# EAGLE design Kinefox_v5 (EAGLE 9.6.2)
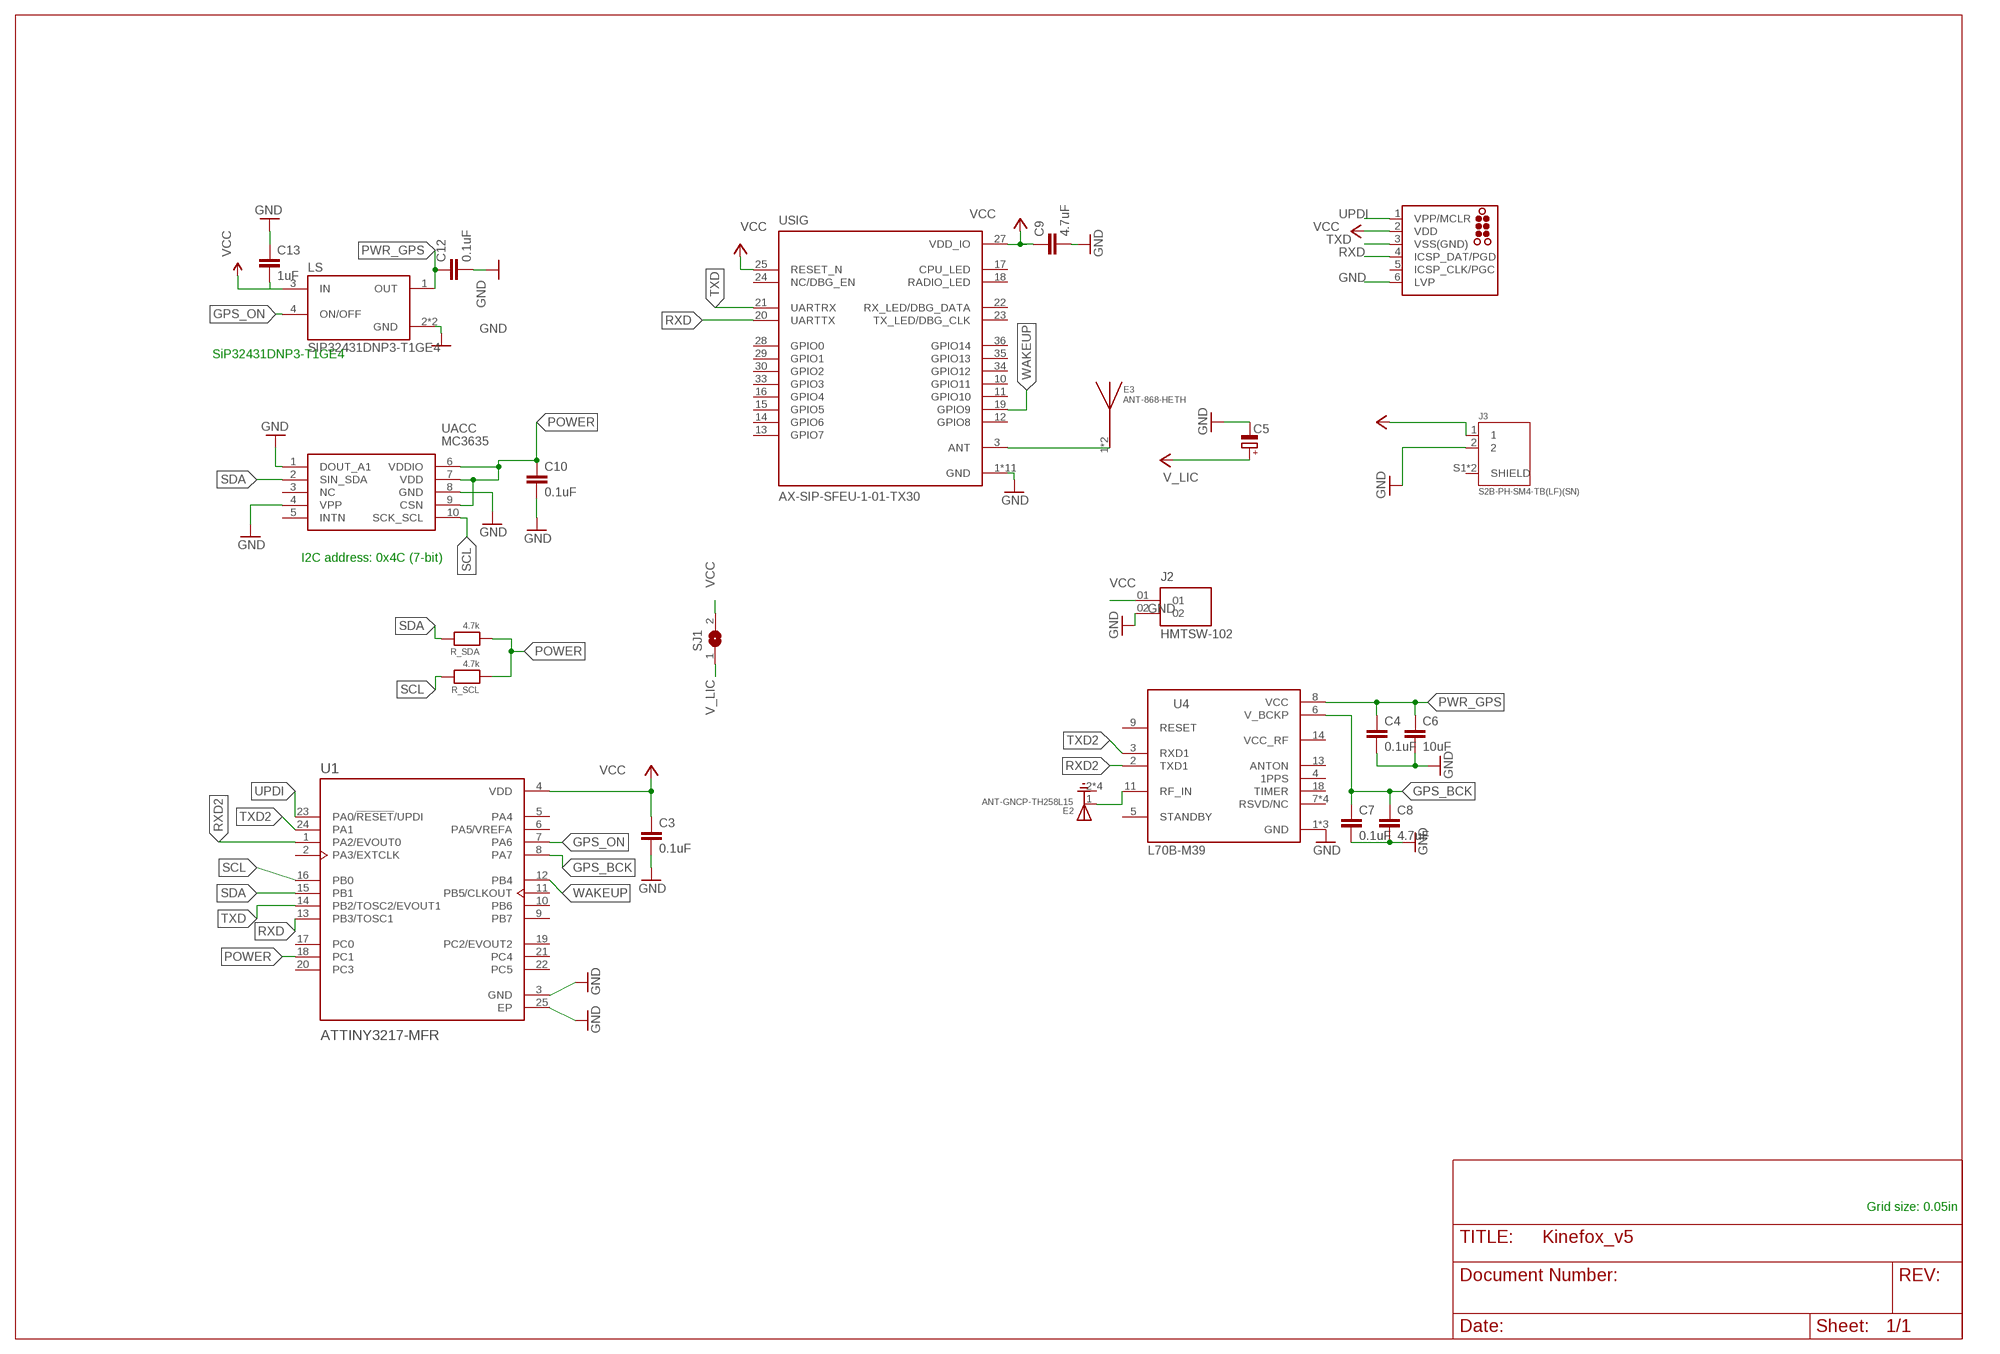
[diagram p0: schematic, sheet 1]

## Parts
C3  0.1uF  C0402_8PF  [C0402]
C4  0.1uF  C0402_8PF  [C0402]
C5  CPOL-EUE3.5-8  [E3,5-8]
C6  10uF  C0402_8PF  [C0402]
C7  0.1uF  C0402_8PF  [C0402]
C8  4.7uF  C0402_8PF  [C0402]
C9  4.7uF  C0402_8PF  [C0402]
C10  0.1uF  C0402_8PF  [C0402]
C12  0.1uF  C0402_8PF  [C0402]
C13  1uF  C0402_8PF  [C0402]
E2  ANT-GNCP-TH258L15  [XCVR_ANT-GNCP-TH258L15]
E3  ANT-868-HETH  [XDCR_ANT-868-HETH]
J1  TC2030-MCP-NL  [TC2030-MCP-NL]
J2  HMTSW-102  HMTSW-102-XX-X-S-XXX  [SAMTEC_HMTSW-102-XX-X-S-XXX]
J3  S2B-PH-SM4-TB(LF)(SN)  [JST_S2B-PH-SM4-TB(LF)(SN)]
LS  SIP32431DNP3-T1GE4  [SON50P120X160X60-5N]
R_SCL  4.7k  MICROBUILDER_RESISTOR_0402  [MICROBUILDER__0402]
R_SDA  4.7k  MICROBUILDER_RESISTOR_0402  [MICROBUILDER__0402]
SJ1  SJ  [SJ]
U1  ATTINY3217-MFR  [QFN50P400X400X90-25N]
U4  L70B-M39  [XCVR_L70B-M39]
UACC  MC3635  [MC3635]
USIG  AX-SIP-SFEU-1-01-TX30  [IC_AX-SIP-SFEU-1-01-TX30]

## Nets
GND: C3.2 C4.2 C5.- C6.2 C7.2 C8.2 C9.2 C10.2 C12.2 C13.1 J1.6(LVP) J2.02 J3.2 LS.2(GND) LS.5(GND) U1.3(GND) U1.25(EP) U4.1(GND) U4.10(GND) U4.12(GND) UACC.1(DOUT_A1) UACC.4(VPP) UACC.8(GND) USIG.1(GND) USIG.2(GND) USIG.4(GND) USIG.6(GND) USIG.26(GND) USIG.P1(GND) USIG.P2(GND) USIG.P3(GND) USIG.P4(GND) USIG.P5(GND) USIG.P6(GND)
GPS_ANT: E2.1(FEEDING) U4.11(RF_IN)
GPS_BCK: C7.1 C8.1 U1.8(PA7) U4.6(V_BCKP)
GPS_ON: LS.4(ON/OFF) U1.7(PA6)
POWER: C10.1 R_SCL.1 R_SDA.1 U1.18(PC1) UACC.6(VDDIO) UACC.7(VDD) UACC.9(CSN)
PWR_GPS: C4.1 C6.1 C12.1 LS.1(OUT) U4.8(VCC)
RXD: J1.4(ICSP_DAT/PGD) U1.13(PB3/TOSC1) USIG.20(UARTTX)
RXD2: U1.1(PA2/EVOUT0) U4.2(TXD1)
SCL: R_SCL.2 U1.16(PB0) UACC.10(SCK_SCL)
SDA: R_SDA.2 U1.15(PB1) UACC.2(SIN_SDA)
SIG_ANT: E3.1(FEED) E3.3(FEED) USIG.3(ANT)
TXD: J1.3(VSS(GND)) U1.14(PB2/TOSC2/EVOUT1) USIG.21(UARTRX)
TXD2: U1.24(PA1) U4.3(RXD1)
UPDI: J1.1(VPP/MCLR) U1.23(PA0/!RESET!/UPDI)
V_LIC: C5.+ SJ1.1 ; supply symbol labelled VCC
VCC: C3.1 C9.1 C13.2 J1.2(VDD) J2.01 J3.1 LS.3(IN) SJ1.2 U1.4(VDD) USIG.25(RESET_N) USIG.27(VDD_IO) ; supply symbol labelled V_BATT
WAKEUP: U1.12(PB4) USIG.19(GPIO9)
Unconnected: J1.5(ICSP_CLK/PGC) J3.S1(SHIELD) J3.S2(SHIELD) U1.2(PA3/EXTCLK) U1.5(PA4) U1.6(PA5/VREFA) U1.9(PB7) U1.10(PB6) U1.11(PB5/CLKOUT) U1.17(PC0) U1.19(PC2/EVOUT2) U1.20(PC3) U1.21(PC4) U1.22(PC5) U4.4(1PPS) U4.5(STANDBY) U4.7(RSVD/NC) U4.9(RESET) U4.13(ANTON) U4.14(VCC_RF) U4.15(RSVD/NC) U4.16(RSVD/NC) U4.17(RSVD/NC) U4.18(TIMER) UACC.3(NC) UACC.5(INTN) USIG.10(GPIO11) USIG.11(GPIO10) USIG.12(GPIO8) USIG.13(GPIO7) USIG.14(GPIO6) USIG.15(GPIO5) USIG.16(GPIO4) USIG.17(CPU_LED) USIG.18(RADIO_LED) USIG.22(RX_LED/DBG_DATA) USIG.23(TX_LED/DBG_CLK) USIG.24(NC/DBG_EN) USIG.28(GPIO0) USIG.29(GPIO1) USIG.30(GPIO2) USIG.33(GPIO3) USIG.34(GPIO12) USIG.35(GPIO13) USIG.36(GPIO14)

## Notes on the sheet
- SiP32431DNP3-T1GE4
- I2C address: 0x4C (7-bit)
- Grid size: 0.05in

## Power pins joined to a net without a drawn wire
GND: E2.2(GND) E2.3(GND) E2.4(GND) E2.5(GND)

## Library data of the parts
C3 C4 C6-C10 C12 C13 = TSEM:C: Non-polarized capacitor; FARNELL_OC: 2210758; MF: TDK; MPN: CGA2B2C0G1H080D050BA; VALUE: 8pF
C5 = qfm-trx1-24g:CPOL-EU: POLARIZED CAPACITOR, European symbol
E2 = ANT-GNCP-TH258L15:ANT-GNCP-TH258L15: L1/L5 Ceramic Patch GNSS Antenna Check availability <https://pricing.snapeda.com/parts/ANT-GNCP-TH258L15/Linx%20Technologies%20Inc./view-part?ref=eda>; AVAILABILITY: In Stock; DESCRIPTION: GNSS L1/L5 Dual-Band Radiating Patch Ceramic Patch Antenna, Internal/Embedded Through-Hole Mount, Solder Pin; MF: Linx Technologies Inc.; MP: ANT-GNCP-TH258L15; PACKAGE: None; PRICE: None; PURCHASE-URL: https://pricing.snapeda.com/search/part/ANT-GNCP-TH258L15/?ref=eda
E3 = ANT-868-HETH:ANT-868-HETH: 868MHZ HELICAL ANT THROUGH HOLE Check availability <https://pricing.snapeda.com/parts/ANT-868-HETH/Linx/view-part?ref=eda>; AVAILABILITY: In Stock; DESCRIPTION: 868MHz ISM, LPWA Helical RF Antenna 862MHz ~ 876MHz 5.6dBi Solder Through Hole; MF: Linx; MP: ANT-868-HETH; PACKAGE: None; PRICE: None; PURCHASE-URL: https://pricing.snapeda.com/search/part/ANT-868-HETH/?ref=eda
J1 = tag-connect:TC2030: TAG-CONNECT ICSP Connector Manufacturer: Tag-Connect <http://www.tag-connect.com> Cable for easy In-Circuit Serial Programming. Designed for Microchip ICD2, suitable for many others. Two variants - one "with legs" (for hands-free fit on PCB) and another "without legs" for quick programming. PAD Description 1 MCLR/Vpp 2 Vdd 3 GND 4 PGD (ISPDAT) 5 PGC (ISPCLK) 6 nc (used for LVP) ©2009 ROFA.cz - modified and updated by Robert Darlington ‹rdarlington@gmail.com›
J2 = HMTSW-102-XX-X-S-XXX:HMTSW-102-XX-X-S-XXX: Connector Header Through Hole 2 position 0.100" (2.54mm) Check availability <https://pricing.snapeda.com/parts/HMTSW-102-06-T-S-000/Samtec/view-part?ref=eda>; AVAILABILITY: In Stock; DESCRIPTION: Conn Unshrouded Header HDR 2 POS 2.54mm Solder ST Top Entry Thru-Hole Bulk; MF: Samtec; MP: HMTSW-102-06-T-S-000; PACKAGE: None; PRICE: None; PURCHASE-URL: https://pricing.snapeda.com/search/part/HMTSW-102-06-T-S-000/?ref=eda
J3 = S2B-PH-SM4-TB_LF__SN_:S2B-PH-SM4-TB(LF)(SN): PH Series 2 Position 2 mm Pitch Surface Mount Side Entry Shrouded Header Check availability <https://pricing.snapeda.com/parts/S2B-PH-SM4-TB%28LF%29%28SN%29/JST%20Sales/view-part?ref=eda>; AVAILABILITY: In Stock; DESCRIPTION: Connector Header Surface Mount, Right Angle 2 position 0.079 (2.00mm); MF: JST Sales; MP: S2B-PH-SM4-TB(LF)(SN); PACKAGE: None; PRICE: None; PURCHASE-URL: https://pricing.snapeda.com/search/part/S2B-PH-SM4-TB(LF)(SN)/?ref=eda
LS = SIP32431DNP3-T1GE4:SIP32431DNP3-T1GE4: Power Switch/Driver 1:1 P-Channel 1.4A 4-TDFN (1.2x1.6) Check prices <https://pricing.snapeda.com/parts/SIP32431DNP3-T1GE4/Vishay%20Siliconix/view-part?ref=eda>; AVAILABILITY: In Stock; DESCRIPTION: Power Switch/Driver 1:1 P-Channel 1.4A 4-TDFN (1.2x1.6); MF: Vishay Siliconix; MP: SIP32431DNP3-T1GE4; PACKAGE: UFDFN-4 Vishay Siliconix; PRICE: None; PURCHASE-URL: https://pricing.snapeda.com/search/part/SIP32431DNP3-T1GE4/?ref=eda
R_SCL R_SDA = TinyPICO:MICROBUILDER_RESISTOR: Resistors 0402 - 0402 Surface Mount Package 22 Ohm 1% 1/16W [Digikey: 311-22.0LRTR-ND] 33 Ohm 5% 1/16W 1.0K 5% 1/16W 1.5K 5% 1/16W 2.0K 1% 1/16W 10.0K 1% 1/16W [Digikey: 311-10.0KLRTR-ND] 10.0K 5% 1/16W [Digikey: RMCF0402JT10K0TR-ND] 12.1K 1% 1/16W [Digikey: 311-22.0LRTR-ND] 100.0K 5% 1/16W 0603 - 0603 Surface Mount Package 0 Ohm 1/10 Watt 1% Resistor 15 Ohm 1/10 Watt 1% Resistor 33 Ohm 1/10 Watt 1% Resistor 49.9 Ohm 1/10 Watt 1% Resistor 100 Ohm 1/10 Watt 1% Resistor 150 Ohm 1/10 Watt 1% Resistor 240 Ohm 1/10 Watt 1% Resistor 390 Ohm 1/10 Watt 1% Resistor 560 Ohm 1/10 Watt 1% Resistor 680 Ohm 1/10 Watt 1% Resistor 750 Ohm 1/10 Watt 1% Resistor 1.0K Ohm 1/10 Watt 1% Resistor 1.5K Ohm 1/10 Watt 1% Resistor 2.0K Ohm 1/10 Watt 1% Resistor 2.2K Ohm 1/10 Watt 1% Resistor 3.3K Ohm 1/10 Watt 1% Resistor 4.7K Ohm 1/10 Watt 1% Resistor 10.0K Ohm 1/10 Watt 1% Resistor 12.0K Ohm 1/10 Watt 1% Resistor 12.1K Ohm 1/10 Watt 1% Resistor 20.0K Ohm 1/10 Watt 1% Resistor 33.0K Ohm 1/10 Watt 1% Resistor 100.0K Ohm 1/10 Watt 1% Resistor 0805 - 0805 Surface Mount Package 0 Ohm 1/8 Watt 1% Resistor 33 Ohm 1/8 Watt 1% Resistor 100 Ohm 1/8 Watt 1% Resistor 150 Ohm 1/8 Watt 1% Resistor 200 Ohm 1/8 Watt 1% Resistor 240 Ohm 1/8 Watt 1% Resistor 330 Ohm 1/8 Watt 1% Resistor 390 Ohm 1/8 Watt 1% Resistor 470 Ohm 1/8 Watt 1% Resistor 1.0K Ohm 1/8 Watt 1% Resistor 1.5K Ohm 1/8 Watt 1% Resistor 2.0K Ohm 1/8 Watt 1% Resistor 4.7K Ohm 1/8 Watt 1% Resistor 5.1K Ohm 1/8 Watt 1% Resistor 5.6K Ohm 1/8 Watt 1% Resistor 10.0K Ohm 1/8 Watt 1% Resistor 22.0K Ohm 1/8 Watt 1% Resistor 33.0K Ohm 1/8 Watt 1% Resistor 100K Ohm 1/8 Watt 1% Resistor 1206 - 1206 Surface Mount Package 2012 - 2010 Surface Mount Package 0.11 Ohm 1/2 Watt 1% Resistor - Digikey: RHM.11UCT-ND
SJ1 = jumper:SJ: SMD solder JUMPER
U1 = ATTINY3217-MFR:ATTINY3217-MFR: 20MHZ, 32KB, QFN24, Ind 125C, Green, T&r Check availability <https://pricing.snapeda.com/parts/ATTINY3217-MFR/Microchip/view-part?ref=eda>; AVAILABILITY: In Stock; DESCRIPTION: AVR tinyAVR™ 1, Functional Safety (FuSa) Microcontroller IC 8-Bit 16MHz 32KB (32K x 8) FLASH 24-VQFN (4x4); MF: Microchip; MP: ATTINY3217-MFR; PACKAGE: VFQFN-24 Microchip Technology; PRICE: None; PURCHASE-URL: https://pricing.snapeda.com/search/part/ATTINY3217-MFR/?ref=eda
U4 = L70B-M39:L70B-M39: GPS Module Check prices <https://pricing.snapeda.com/parts/L70B-M39/Quectel/view-part?ref=eda> Check prices <https://pricing.snapeda.com/parts/L70B-M39/Quectel/view-part?ref=eda> Check availability <https://pricing.snapeda.com/parts/L70B-M39/Quectel/view-part?ref=eda>; AVAILABILITY: In Stock; DESCRIPTION: L70, an SMD type module, brings the high performance of MTK positioning engine to the industrial applications with compact profile, ultra low power consumption and fast positioning capability.; MF: Quectel; MP: L70B-M39; PACKAGE: None; PRICE: None; PURCHASE-URL: https://pricing.snapeda.com/search/part/L70B-M39/?ref=eda
UACC = MC3635:MC3635: Accelerometers Digital Output 3 Axis Acceleronmeter Source: Datasheet <http://www.mcubemems.com/wp-content/uploads/2017/09/MC3635-Datasheet-APS-048-0044v1.5.pdf>; ARROW_PART_NUMBER: MC3635; ARROW_PRICE-STOCK: https://www.arrow.com/en/products/mc3635/mcube-inc; DESCRIPTION: Accelerometers Digital Output 3 Axis Acceleronmeter; HEIGHT: 0.94mm; MANUFACTURER_NAME: mCube; MANUFACTURER_PART_NUMBER: MC3635; MOUSER_PART_NUMBER: 498-MC3635; MOUSER_PRICE-STOCK: https://www.mouser.co.uk/ProductDetail/mCube/MC3635?qs=xIT89idmjZlQ0wKEjJ43VQ%3D%3D
USIG = AX-SIP-SFEU-1-01-TX30-V2:AX-SIP-SFEU-1-01-TX30: RF-MICROCONTROLLER, ULTRA Check prices <https://pricing.snapeda.com/parts/AX-SIP-SFEU-1-01-TX30/ON%20Semiconductor/view-part?ref=eda>; AVAILABILITY: In Stock; DESCRIPTION: Sigfox Transceiver Module 868.13MHz, 869.525MHz Antenna Not Included Surface Mount; MF: ON Semiconductor; MP: AX-SIP-SFEU-1-01-TX30; PACKAGE: SIP-38 ON Semiconductor; PRICE: None

## Board
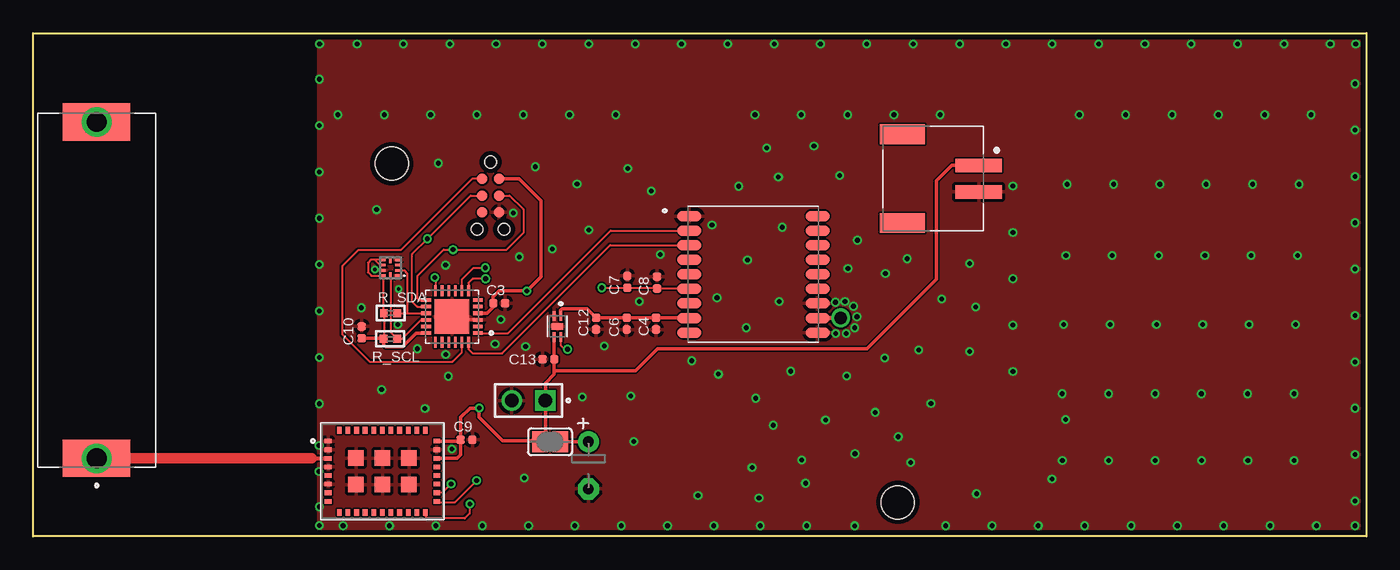
[diagram p1: board, top side]
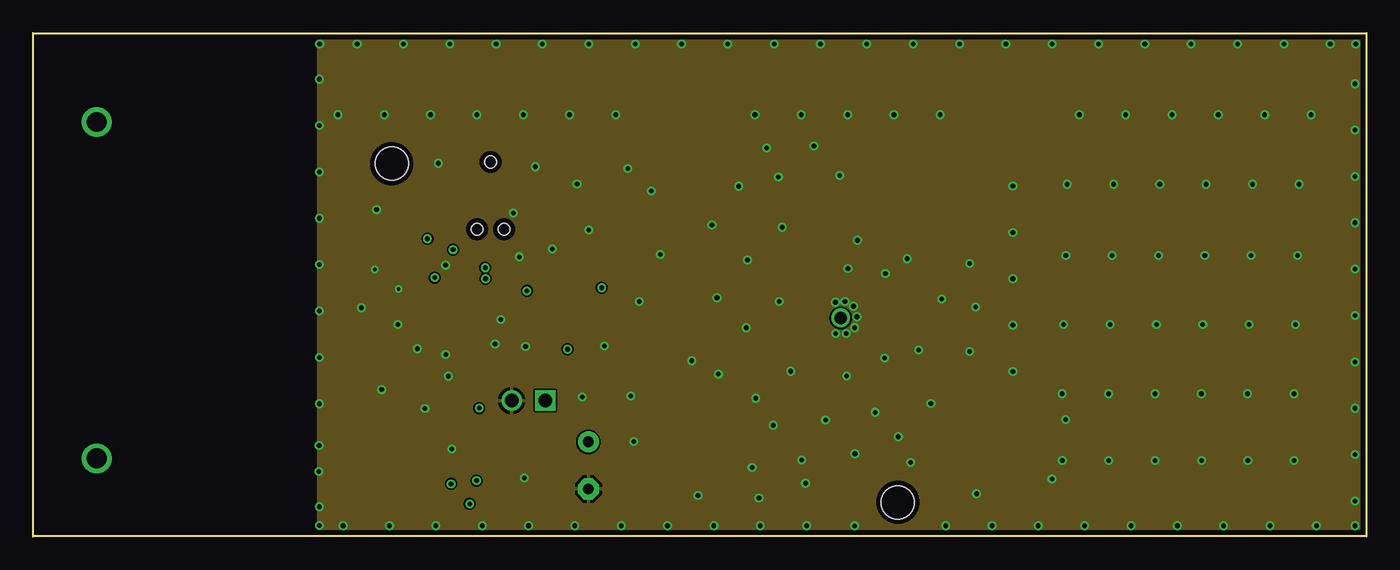
[diagram p2: board, inner layer GND]
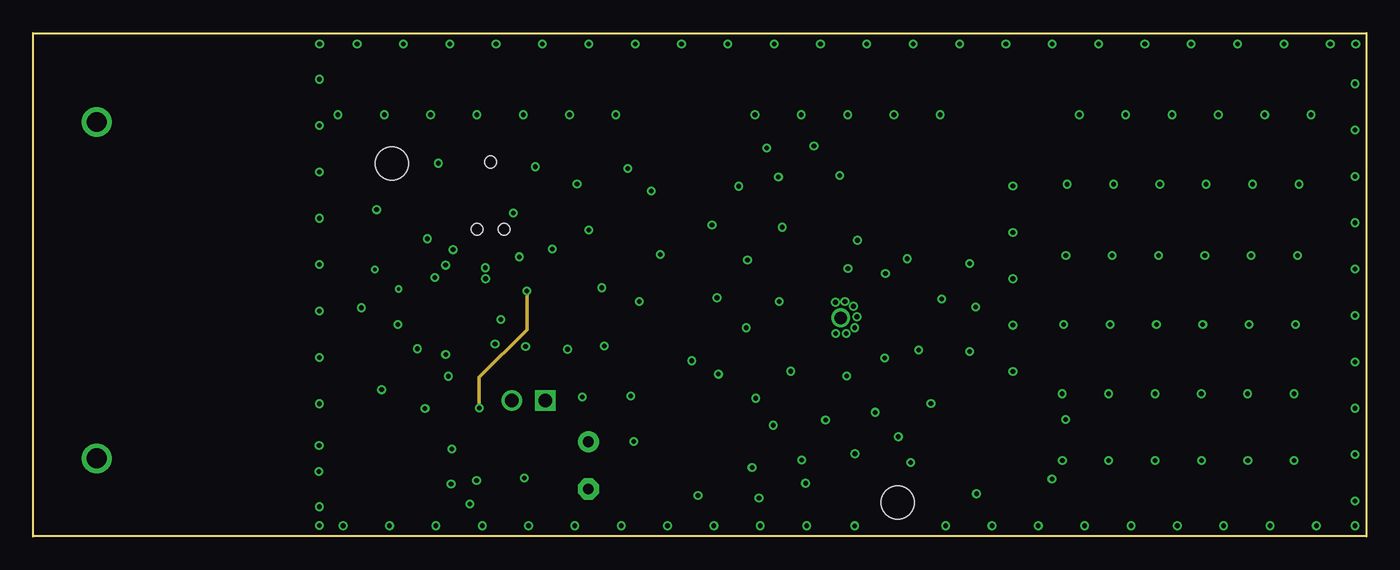
[diagram p3: board, inner layer 3.3V]
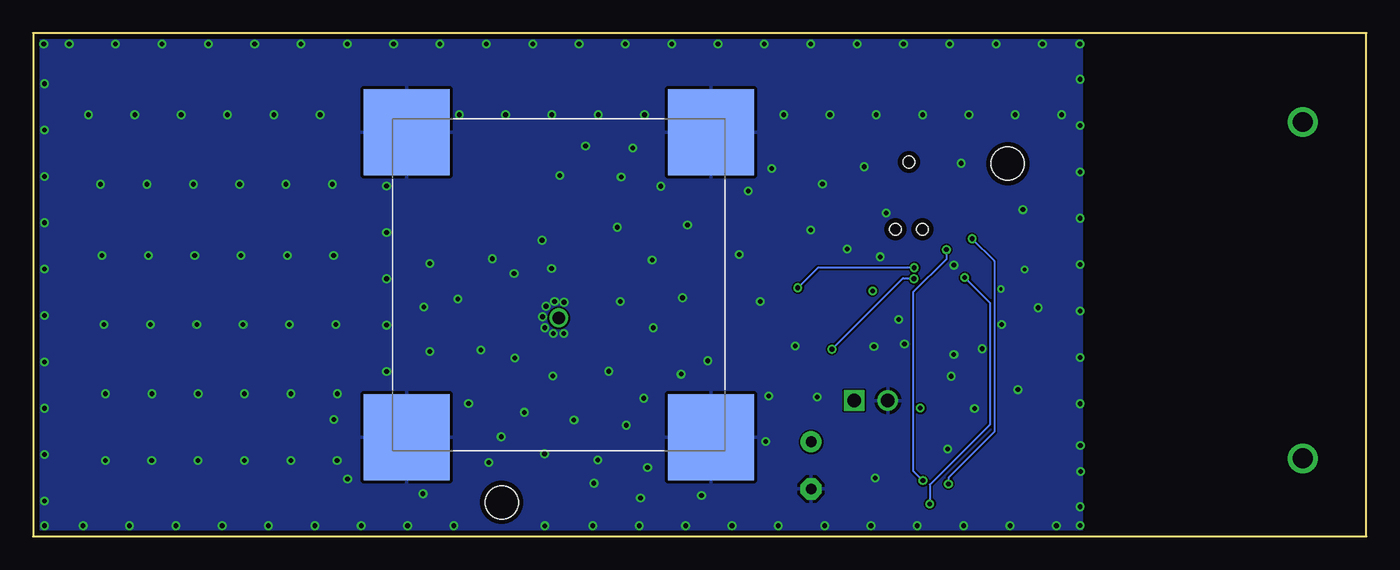
[diagram p4: board, bottom side, seen from below]

Size 100.7 x 38 mm. Coordinates in mm from the lower left corner, seen from the top.
Outline: 0,0 0,38 100.7,38 100.7,0 0,0
Copper layers (1+2*15+16): Top 0.0356mm / dielectric 0.1702mm / GND 0.0178mm / dielectric 47mil / 3.3V 0.0178mm / dielectric 0.1702mm / Bottom 0.0356mm
Design rules "ESP32-TrackerREV2-4LayerOSHPark *": minimum track width 5mil, minimum drill 0.2mm, track to track 5mil, track to pad 5mil, pad to pad 5mil, via to via 5mil, smd to smd 5mil, copper to edge 15mil, drill to drill 6mil, minimum pad ring 6mil, minimum via ring 6mil, stop-mask expansion 0mil, vias tented up to drill 12mil, thermal gap 10mil
Holes 2.5 mm at 27.08,28.14 65.31,2.57

### Footprints (pad centres in the part's own frame; a part is rotated, then mirrored left to right if it is on the bottom)
C0402 = smd 0.635 x 0.635: 1 -0.445,0; 2 0.445,0
E3,5-8 = drill 0.813 pad 1.6: + -1.778,0 | drill 0.813 pad 1.6 octagon: - 1.778,0
XCVR_ANT-GNCP-TH258L15 = drill 0.95: 1 0,-2.5 | smd 6.5 x 6.5: 2 11.5,11.5; 3 -11.5,11.5; 4 -11.5,-11.5; 5 11.5,-11.5
XDCR_ANT-868-HETH = smd 2.8 x 5.1: 1 -12.7,0; 2 12.7,0 | drill 1.5: 3 -12.7,0; 4 12.7,0
TC2030-MCP-NL = smd 0.787 x 0.787: 1 1.27,-0.635; 2 1.27,0.635; 3 2.54,-0.635; 4 2.54,0.635; 5 3.81,-0.635; 6 3.81,0.635 | hole 0.889: 0,0; 5.08,-1.016; 5.08,1.016
SAMTEC_HMTSW-102-XX-X-S-XXX = drill 1.02 square: 01 1.27,0 | drill 1.02: 02 -1.27,0
JST_S2B-PH-SM4-TB(LF)(SN) = smd 1 x 3.5: 1 -1,0; 2 1,0 | smd 1.5 x 3.4: S1 -3.35,-5.75; S2 3.35,-5.75
SON50P120X160X60-5N = smd 0.71 x 0.27: 1 -0.795,0.25; 2 -0.795,-0.25; 3 0.795,-0.25; 4 0.795,0.25 | smd 0.5 x 0.86: 5 0,0
MICROBUILDER__0402 = smd 0.6 x 0.6: 1 -0.508,0; 2 0.508,0
SJ = smd 1.168 x 1.6: 1 -0.762,0; 2 0.762,0
QFN50P400X400X90-25N = smd 0.81 x 0.26: 1 -1.95,1.25; 2 -1.95,0.75; 3 -1.95,0.25; 4 -1.95,-0.25; 5 -1.95,-0.75; 6 -1.95,-1.25; 13 1.95,-1.25; 14 1.95,-0.75; 15 1.95,-0.25; 16 1.95,0.25; 17 1.95,0.75; 18 1.95,1.25 | smd 0.26 x 0.81: 7 -1.25,-1.95; 8 -0.75,-1.95; 9 -0.25,-1.95; 10 0.25,-1.95; 11 0.75,-1.95; 12 1.25,-1.95; 19 1.25,1.95; 20 0.75,1.95; 21 0.25,1.95; 22 -0.25,1.95; 23 -0.75,1.95; 24 -1.25,1.95 | smd 2.6 x 2.6: 25 0,0
XCVR_L70B-M39 = smd 1.8 x 0.8: 1 -4.85,4.4; 2 -4.85,3.3; 3 -4.85,2.2; 4 -4.85,1.1; 5 -4.85,0; 6 -4.85,-1.1; 7 -4.85,-2.2; 8 -4.85,-3.3; 9 -4.85,-4.4; 10 4.85,-4.4; 11 4.85,-3.3; 12 4.85,-2.2; 13 4.85,-1.1; 14 4.85,0; 15 4.85,1.1; 16 4.85,2.2; 17 4.85,3.3; 18 4.85,4.4
MC3635 = smd 0.2 x 0.4: 1 -0.6,-0.55; 2 -0.2,-0.55; 3 0.2,-0.55; 4 0.6,-0.55; 6 0.6,0.55; 7 0.2,0.55; 8 -0.2,0.55; 9 -0.6,0.55 | smd 0.4 x 0.2: 5 0.55,0; 10 -0.55,0
IC_AX-SIP-SFEU-1-01-TX30 = smd 0.5 x 0.35: 1 -4.1,2.275; 2 -4.1,1.625; 3 -4.1,0.975; 4 -4.1,0.325; 5 -4.1,-0.325; 6 -4.1,-0.975; 7 -4.1,-1.625; 8 -4.1,-2.275; 20 4.1,-2.275; 21 4.1,-1.625; 22 4.1,-0.975; 23 4.1,-0.325; 24 4.1,0.325; 25 4.1,0.975; 26 4.1,1.625; 27 4.1,2.275 | smd 0.35 x 0.5: 9 -3.25,-3.1; 10 -2.6,-3.1; 11 -1.95,-3.1; 12 -1.3,-3.1; 13 -0.65,-3.1; 14 0,-3.1; 15 0.65,-3.1; 16 1.3,-3.1; 17 1.95,-3.1; 18 2.6,-3.1; 19 3.25,-3.1; 28 3.25,3.1; 29 2.6,3.1; 30 1.95,3.1; 31 1.3,3.1; 32 0.65,3.1; 33 0,3.1; 34 -0.65,3.1; 35 -1.3,3.1; 36 -1.95,3.1; 37 -2.6,3.1; 38 -3.25,3.1 | smd 1.2 x 1.2: P1 -2,1; P2 -2,-1; P3 0,-1; P4 2,-1; P5 2,1; P6 0,1

### Placement (x,y rotation side)
C3  35.2,17.6 0 top
C4  47.04,16.06 270 top
C5  41.94,5.36 270 top
C6  44.83,16.06 270 top
C7  44.88,19.22 90 top
C8  47.12,19.17 90 top
C9  32.73,7.3 0 top
C10  24.81,15.41 90 top
C12  42.51,16.07 270 top
C13  38.92,13.38 0 top
E2  61,19 0 bottom
E3  4.8,18.59 90 top
J1  34.55,28.27 270 top
J2  37.42,10.26 0 top
J3  71.42,27.01 270 top
LS  39.6,15.86 270 top
R_SCL  26.98,14.92 0 top
R_SDA  27,16.86 0 top
SJ1  39.04,7.14 180 top
U1  31.64,16.6 180 top
U4  54.4,19.79 0 top
UACC  26.99,20.28 90 top
USIG  26.38,4.92 0 top

### Tracks (layer width: path | path; a pad name or v marks a point on that pad's centre or on a via)
GND  (via drill 0.25, 0.35)
  Top 0.254: U1.3 31.89,16.35
  Top 0.35: 31.89,16.35 U1.25
  other vias: 31.62,6.59 21.6,6.87 21.58,4.91 21.62,2.24 21.61,0.82 21.62,10.02 21.62,13.52 21.62,17.02 21.62,20.52 21.62,24.02 21.62,27.52 21.62,31.02 21.62,34.52 21.64,37.19 24.47,37.19 27.97,37.19 31.47,37.19 34.97,37.19 38.47,37.19 41.97,37.19 45.47,37.19 48.97,37.19 52.47,37.19 55.97,37.19 59.47,37.19 62.97,37.19 66.47,37.19 69.97,37.19 73.47,37.19 76.97,37.19 80.47,37.19 83.97,37.19 87.47,37.19 90.97,37.19 94.47,37.19 97.97,37.19 99.9,37.18 99.84,34.18 99.84,30.68 99.84,27.18 99.84,23.68 99.84,20.18 99.84,16.68 99.84,13.18 99.84,9.68 99.84,6.18 99.84,2.68 99.84,0.81 96.92,0.81 93.42,0.81 89.92,0.81 86.42,0.81 82.92,0.81 79.42,0.81 75.92,0.81 72.42,0.81 68.92,0.81 66.27,5.59 54.82,2.9 58.42,0.81 54.92,0.81 51.42,0.81 47.92,0.81 44.42,0.81 40.92,0.81 37.42,0.81 33.92,0.81 30.42,0.81 26.92,0.81 23.42,0.81 71.25,3.22 76.95,4.34 77.98,8.83 74,12.45 74,15.95 74,19.45 74,22.95 74,26.45 49.74,13.26 59.85,8.79 23.02,31.84 26.52,31.84 30.02,31.84 33.52,31.84 37.02,31.84 40.52,31.84 44.02,31.84 54.52,31.84 58.02,31.84 61.52,31.84 65.02,31.84 68.52,31.84 58.98,29.48 66.89,14.08 79.02,31.84 82.52,31.84 86.02,31.84 89.52,31.84 93.02,31.84 96.52,31.84 41.08,26.62 61.32,17.73 62.22,16.59 61.4,15.31 37.09,4.41 26.32,11.08 25.94,24.67 50.22,3.1 58.34,4.01 54.57,10.43 60.91,27.24 68.61,17.93 43.14,14.37 24.8,17.27 30.6,28.17 39.21,21.7 31.36,12.09 45.13,10.61 51.65,18.02 56.36,17.73 56.59,23.34 51.27,23.52 62.05,0.8 62.07,6.24 61.46,12.1 62.26,22.36 44.91,27.77 37.94,27.91 67.81,10.03 78.1,26.59 81.6,26.59 85.1,26.59 88.6,26.59 92.1,26.59 95.6,26.59 78,21.22 81.5,21.22 85,21.22 88.5,21.22 92,21.22 95.5,21.22 77.84,15.99 81.34,15.99 84.84,15.99 88.34,15.99 91.84,15.99 95.34,15.99 77.73,10.77 81.23,10.77 84.73,10.77 88.23,10.77 91.73,10.77 95.23,10.77 77.74,5.74 81.24,5.74 84.74,5.74 88.24,5.74 91.74,5.74 95.24,5.74 54.3,5.21 66.01,20.96 56.29,27.13 41.96,23.13 47.38,21.28 45.37,7.16 31.15,20.48 53.95,20.88 35.32,16.39 36.28,24.42 31.16,13.73 34.89,14.53 27.55,15.99 29.02,14.17 25.82,20.16 27.6,18.69 60.6,17.68 61.96,17.38 62.06,15.75 60.62,15.33 53.29,26.44 46.69,26.08 53.87,15.75 64.37,19.84 70.74,13.96 70.74,20.6 63.61,9.37 55.89,8.39 57.23,12.47 51.76,12.25 61.54,20.24 58.04,5.78 65.35,7.53 71.19,17.32 55.4,29.32 45.79,17.73 29.6,9.66 37.19,14.34 36.71,21.11 41.49,10.52 64.31,13.47
  pour Bottom: 21.5,0 100.7,0 100.7,38 21.5,38
  pour Top: 21.5,0 100.7,0 100.7,38 21.5,38
  pour GND: 21.5,0 100.7,0 100.7,38 21.5,38
GPS_ANT
  Top 0.305: E2.1 U4.11
GPS_BCK  (via drill 0.35)
  Top 0.152: U1.8 32.39,19.4 33.27,20.28 v34.15,20.28 | v42.94,18.78 C7.1 47.07,18.78 C8.1 49.51,18.73 U4.6
  Bottom 0.152: v34.15,20.28 41.44,20.28 v42.94,18.78
GPS_ON  (via drill 0.35)
  Top 0.152: v34.17,19.45 33.2,19.45 32.89,19.14 U1.7 | LS.4 39.85,14.43 40.15,14.13 v40.37,14.13
  Bottom 0.152: v34.17,19.45 34.22,19.5 35,19.5 v40.37,14.13
POWER
  Top 0.152: 26.44,16.91 UACC.9 25.56,19.68 25.3,19.94 25.3,20.67 25.51,20.88 25.8,20.88 | UACC.6 25.8,20.88 | UACC.7 26.2,20.48 25.8,20.88 | R_SDA.1 26.49,15.03 26.43,14.97
  Top 0.254: C10.1 26.43,14.97 R_SCL.1 26.47,14.49 26.65,14.31 27.89,14.31 28.93,15.35 U1.18 | 26.44,16.91 R_SDA.1
PWR_GPS
  Top 0.254: LS.1 39.85,17.08 39.95,17.18 41.84,17.18 C12.1 44.82,16.52 C6.1 C4.1 49.53,16.5 U4.8
RXD  (via drill 0.35)
  Top 0.152: J1.4 35.98,25.73 37.03,24.68 37.03,22.91 35.77,21.65 v31.72,21.65 31.02,21.65 29.01,19.64 29.01,17.98 29.14,17.85 U1.13 | USIG.20 30.58,2.54 31.82,2.54 v33.49,4.21
  Bottom 0.152: v31.72,21.65 31.72,20.94 34.24,18.42 34.24,4.96 v33.49,4.21
RXD2
  Top 0.152: U1.1 35.88,15.35 43.62,23.09 U4.2
SCL
  Top 0.152: U1.16 29.29,16.35 27.86,14.92 R_SCL.2 27,15.4 27,19.71 UACC.10
SDA
  Top 0.152: R_SDA.2 28.26,16.86 | 28.26,16.86 U1.15 | UACC.2 28.03,20.08 28.26,19.85 28.26,16.86
SIG_ANT
  Top 0.305: 21.05,5.89 USIG.3
  Top 0.8: E3.3 20.74,5.89 21.05,5.89
TXD  (via drill 0.35)
  Top 0.152: U1.14 29.02,17.35 28.64,17.73 28.64,21.33 v29.78,22.47 29.8,22.47 33.06,25.73 J1.3 | v31.57,3.96 30.91,3.29 USIG.21
  Bottom 0.152: v29.78,22.47 28.11,20.8 28.11,7.89 31.56,4.44 v31.56,3.97 v31.57,3.96
TXD2
  Top 0.152: U1.24 32.89,14.14 33.21,13.82 35.42,13.82 43.59,21.99 U4.3
UPDI
  Top 0.152: J1.1 33.16,27 27.77,21.61 24.55,21.61 23.34,20.4 23.34,15.26 25.41,13.19 31.68,13.19 32.39,13.9 U1.23
V_LIC
  Top 0.254: C5.+ SJ1.1
VCC  (via drill 0.35)
  Top 0.152: SJ1.2 38.28,7.21 38.69,7.62
  Top 0.254: C9.1 32.18,7.2 USIG.27 | 39.36,12.52 C13.2 39.35,13.39 LS.3 | 39.36,12.52 39.36,12.24 38.69,11.57 J2.01 38.69,7.62 | U1.4 34.31,16.85 34.76,17.3 C3.1 34.76,18.1 35.21,18.55 v37.29,18.55 v37.3,18.54 38.35,19.59 38.35,25.34 36.69,27 J1.2 | 39.36,12.52 45.51,12.52 47.16,14.17 62.99,14.17 68.23,19.41 68.23,26.86 69.38,28.01 J3.1 | USIG.25 32.02,5.89 32.28,6.16 C9.1 | C9.1 32.28,8.99 32.99,9.69 v33.7,9.69 33.7,8.99 35.45,7.24 38.38,7.24 SJ1.2
  3.3V 0.254: v37.3,18.54 37.3,15.62 33.7,12.02 v33.7,9.69
WAKEUP  (via drill 0.35)
  Top 0.152: v32.98,2.46 32.98,1.74 32.6,1.36 29.8,1.36 29.63,1.53 USIG.19 | v30.34,19.54 30.39,19.49 U1.12
  Bottom 0.152: v30.34,19.54 28.45,17.65 28.45,8.44 32.98,3.91 v32.98,2.46